# EAGLE board registers_half_layout_newwithwires (EAGLE 9.5.2), part 1 of 2
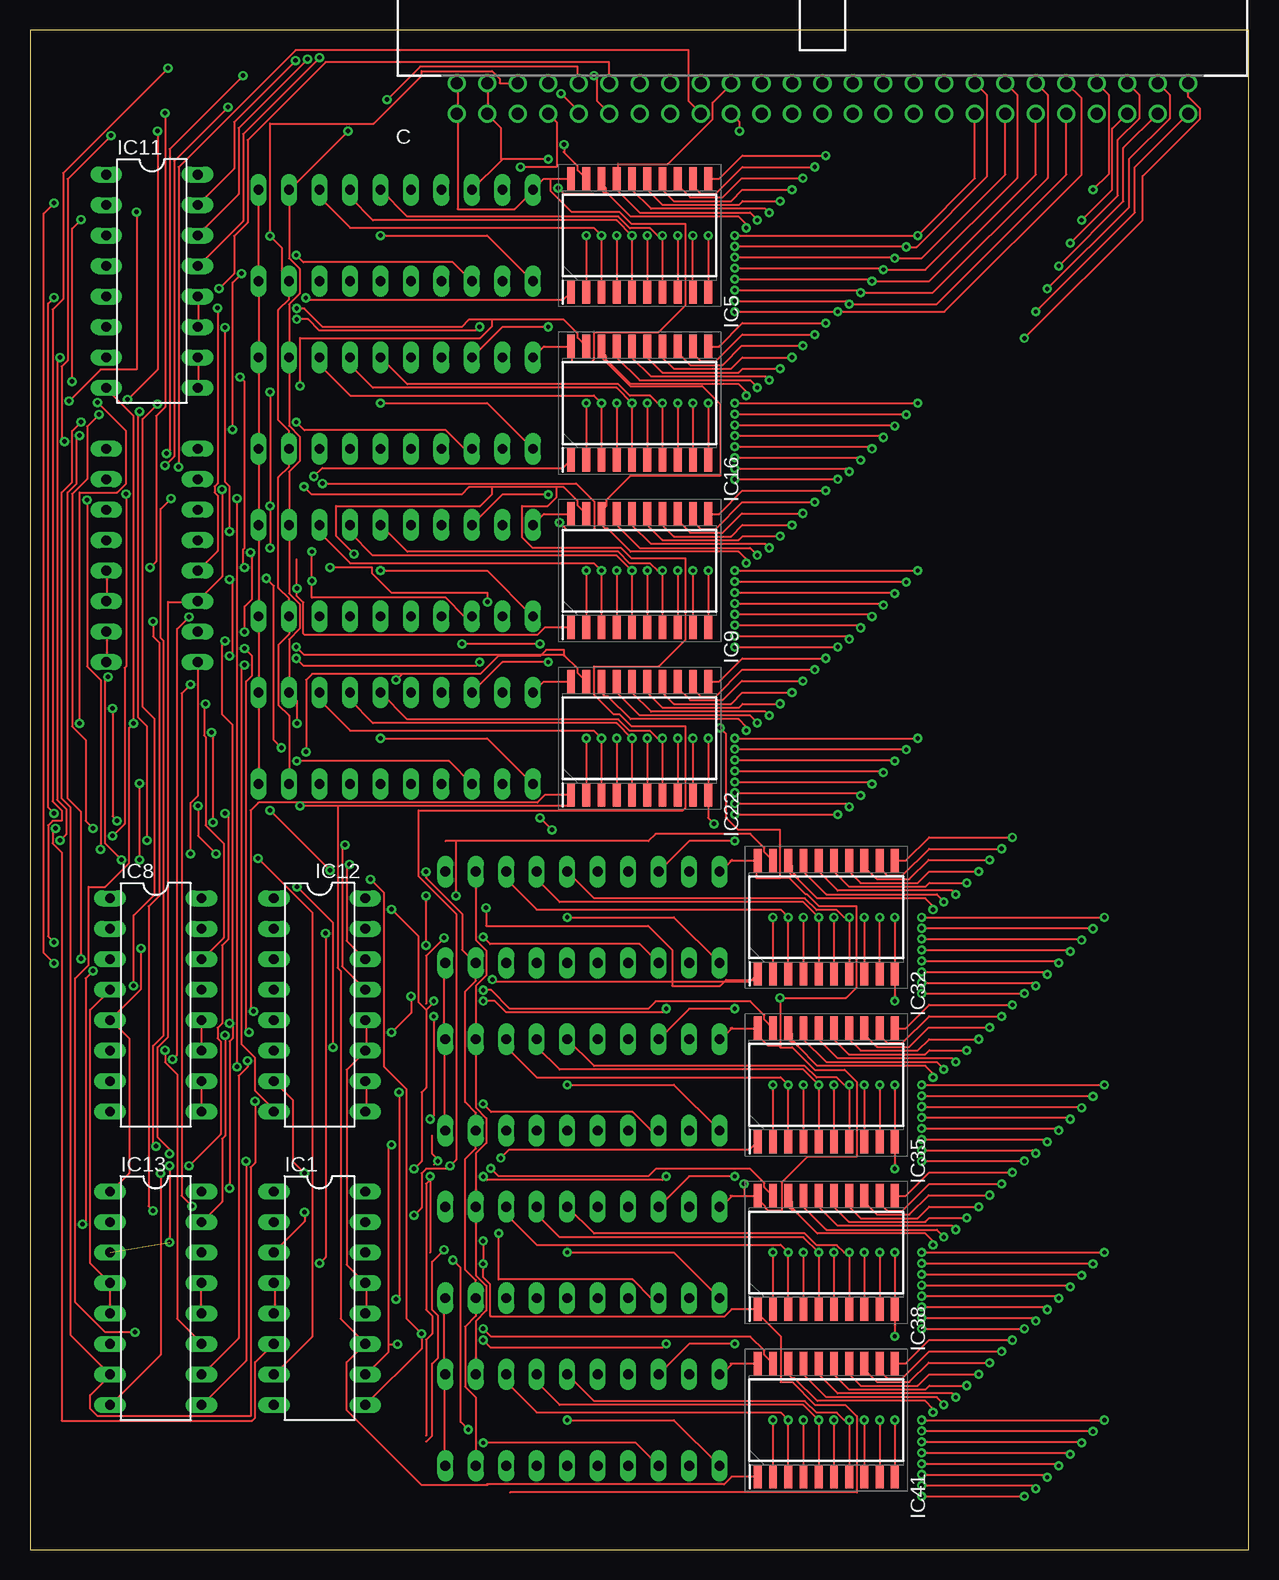
[diagram p2: board, top side]
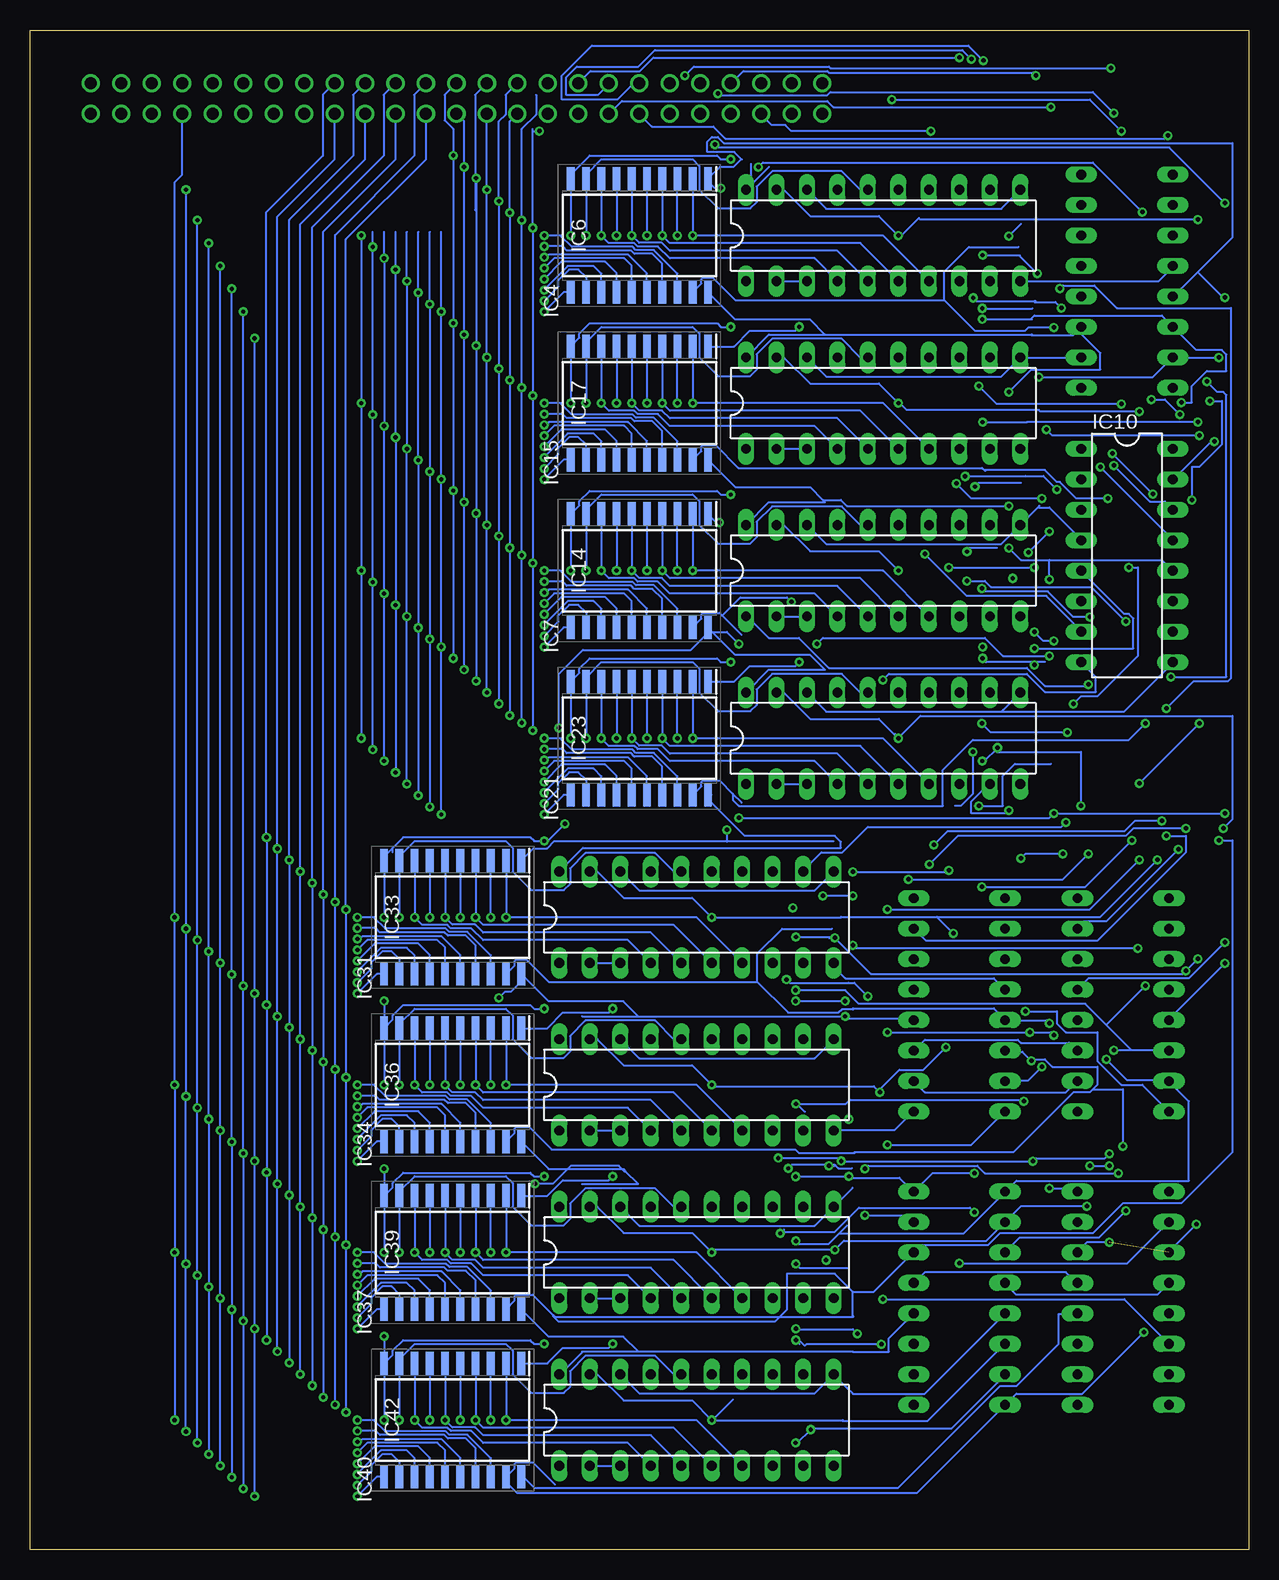
[diagram p3: board, bottom side, seen from below]

Size 101.58 x 126.67 mm. Coordinates in mm from the lower left corner, seen from the top.
Outline: 0,0 101.58,0 101.58,126.67 0,126.67 0,0
Copper layers (1*16): Top 0.035mm / dielectric 1.5mm / Bottom 0.035mm
Design rules "default *": minimum track width 6mil, minimum drill 0.35mm, track to track 6mil, track to pad 6mil, pad to pad 6mil, via to via 6mil, smd to smd 6mil, copper to edge 40mil, drill to drill 6mil, minimum pad ring 10mil, minimum via ring 8mil, stop-mask expansion 4mil, vias tented up to drill 0mil, thermal gap 10mil
tRestrict: area 61,4.1 to 97.8,122.2; area 92.7,114.6 to 101.6,122.2
bRestrict: area 58.4,4.1 to 90.2,122.2; area 90.2,114.6 to 101.6,122.2; area 88.9,114.6 to 90.2,122.2

## Footprints (pad centres in the part's own frame; a part is rotated, then mirrored left to right if it is on the bottom)
PAK100/2500-5-50 = drill 1 pad 1.422: 1 -30.48,-1.27; 2 -30.48,1.27; 3 -27.94,-1.27; 4 -27.94,1.27; 5 -25.4,-1.27; 6 -25.4,1.27; 7 -22.86,-1.27; 8 -22.86,1.27; 9 -20.32,-1.27; 10 -20.32,1.27; 11 -17.78,-1.27; 12 -17.78,1.27; 13 -15.24,-1.27; 14 -15.24,1.27; 15 -12.7,-1.27; 16 -12.7,1.27; 17 -10.16,-1.27; 18 -10.16,1.27; 19 -7.62,-1.27; 20 -7.62,1.27; 21 -5.08,-1.27; 22 -5.08,1.27; 23 -2.54,-1.27; 24 -2.54,1.27; 25 0,-1.27; 26 0,1.27; 27 2.54,-1.27; 28 2.54,1.27; 29 5.08,-1.27; 30 5.08,1.27; 31 7.62,-1.27; 32 7.62,1.27; 33 10.16,-1.27; 34 10.16,1.27; 35 12.7,-1.27; 36 12.7,1.27; 37 15.24,-1.27; 38 15.24,1.27; 39 17.78,-1.27; 40 17.78,1.27; 41 20.32,-1.27; 42 20.32,1.27; 43 22.86,-1.27; 44 22.86,1.27; 45 25.4,-1.27; 46 25.4,1.27; 47 27.94,-1.27; 48 27.94,1.27; 49 30.48,-1.27; 50 30.48,1.27
DIL16 = drill 0.813 long: 1 -8.89,-3.81; 2 -6.35,-3.81; 3 -3.81,-3.81; 4 -1.27,-3.81; 5 1.27,-3.81; 6 3.81,-3.81; 7 6.35,-3.81; 8 8.89,-3.81; 9 8.89,3.81; 10 6.35,3.81; 11 3.81,3.81; 12 1.27,3.81; 13 -1.27,3.81; 14 -3.81,3.81; 15 -6.35,3.81; 16 -8.89,3.81
DIL20 = drill 0.813 long: 1 -11.43,-3.81; 2 -8.89,-3.81; 3 -6.35,-3.81; 4 -3.81,-3.81; 5 -1.27,-3.81; 6 1.27,-3.81; 7 3.81,-3.81; 8 6.35,-3.81; 9 8.89,-3.81; 10 11.43,-3.81; 11 11.43,3.81; 12 8.89,3.81; 13 6.35,3.81; 14 3.81,3.81; 15 1.27,3.81; 16 -1.27,3.81; 17 -3.81,3.81; 18 -6.35,3.81; 19 -8.89,3.81; 20 -11.43,3.81
SOIC127P1030X265-20N = smd 1.95 x 0.65: 1 -4.725,5.715; 2 -4.725,4.445; 3 -4.725,3.175; 4 -4.725,1.905; 5 -4.725,0.635; 6 -4.725,-0.635; 7 -4.725,-1.905; 8 -4.725,-3.175; 9 -4.725,-4.445; 10 -4.725,-5.715; 11 4.725,-5.715; 12 4.725,-4.445; 13 4.725,-3.175; 14 4.725,-1.905; 15 4.725,-0.635; 16 4.725,0.635; 17 4.725,1.905; 18 4.725,3.175; 19 4.725,4.445; 20 4.725,5.715

## Placement (x,y rotation side)
C  2550-5  [PAK100/2500-5-50]  66.04,120.97 0 top
IC1  74AC11032  [DIL16]  24.13,20.95 270 top
IC4  74HCT299N  [DIL20]  30.48,109.54 0 bottom
IC5  SN74CBT3345DW  [SOIC127P1030X265-20N]  50.8,109.54 90 top
IC6  SN74CBT3345DW  [SOIC127P1030X265-20N]  50.8,109.54 270 bottom
IC7  74HCT299N  [DIL20]  30.48,81.6 0 bottom
IC8  74AC11138  [DIL16]  10.48,45.4 270 top
IC9  SN74CBT3345DW  [SOIC127P1030X265-20N]  50.8,81.6 90 top
IC10  74AC11238  [DIL16]  10.16,82.87 270 bottom
IC11  74AC11238  [DIL16]  10.16,105.73 270 top
IC12  74AC11138  [DIL16]  24.13,45.4 270 top
IC13  74AC11032  [DIL16]  10.48,20.95 270 top
IC14  SN74CBT3345DW  [SOIC127P1030X265-20N]  50.8,81.6 270 bottom
IC15  74HCT299N  [DIL20]  30.48,95.57 0 bottom
IC16  SN74CBT3345DW  [SOIC127P1030X265-20N]  50.8,95.57 90 top
IC17  SN74CBT3345DW  [SOIC127P1030X265-20N]  50.8,95.57 270 bottom
IC21  74HCT299N  [DIL20]  30.48,67.63 0 bottom
IC22  SN74CBT3345DW  [SOIC127P1030X265-20N]  50.8,67.63 90 top
IC23  SN74CBT3345DW  [SOIC127P1030X265-20N]  50.8,67.63 270 bottom
IC31  74HCT299N  [DIL20]  46.04,52.7 0 bottom
IC32  SN74CBT3345DW  [SOIC127P1030X265-20N]  66.36,52.7 90 top
IC33  SN74CBT3345DW  [SOIC127P1030X265-20N]  66.36,52.7 270 bottom
IC34  74HCT299N  [DIL20]  46.04,38.73 0 bottom
IC35  SN74CBT3345DW  [SOIC127P1030X265-20N]  66.36,38.73 90 top
IC36  SN74CBT3345DW  [SOIC127P1030X265-20N]  66.36,38.73 270 bottom
IC37  74HCT299N  [DIL20]  46.04,24.77 0 bottom
IC38  SN74CBT3345DW  [SOIC127P1030X265-20N]  66.36,24.77 90 top
IC39  SN74CBT3345DW  [SOIC127P1030X265-20N]  66.36,24.77 270 bottom
IC40  74HCT299N  [DIL20]  46.04,10.79 0 bottom
IC41  SN74CBT3345DW  [SOIC127P1030X265-20N]  66.36,10.79 90 top
IC42  SN74CBT3345DW  [SOIC127P1030X265-20N]  66.36,10.79 270 bottom

## Tracks (layer width: path | path; a pad name or v marks a point on that pad's centre or on a via)
BUSA_BIT0  (via drill 0.35)
  Top 0.152: v59.69,110.17 59.69,110.49 59.05,111.12 50.05,111.12 48.15,113.03 48,113.03 | 47.62,113.35 47.94,113.03 48,113.03 | v59.69,96.2 59.69,96.52 59.05,97.16 50.05,97.16 48.15,99.06 48,99.06 | 47.62,99.38 47.94,99.06 48,99.06 | v59.69,82.23 59.69,82.55 59.05,83.19 50.05,83.19 48.15,85.09 47.94,85.09 47.62,85.41 | v59.69,68.26 59.69,68.58 59.05,69.22 50.05,69.22 48.15,71.12 47.94,71.12 47.62,71.44 IC22.18 | IC9.18 47.5,86.5 48,87 48,87.5 50,89.5 57.5,89.5 57.5,95.5 56,97 50,97 48,99 48,99.06 | 48,99.06 48,99.5 47.5,100 IC16.18 | 48,113.03 48,113.5 47.5,114 IC5.18 | 48,113 48,113.03 | v59.12,118.25 59.12,119 58.5,119.62 C.19
  Bottom 0.152: v59.69,68.26 v59.69,82.23 v59.69,96.2 v59.69,110.17 59.69,118.25 | 59.69,118.25 59.69,118.43 | 59.69,118.25 v59.12,118.25
BUSA_BIT1  (via drill 0.35)
  Top 0.152: v60.6,110.82 60.6,110.85 60.01,111.44 50.8,111.44 48.9,113.35 IC5.17 49,114.38 49,115.5 53.12,115.5 56.88,119.25 56.88,120.62 58.38,122.12 C.20 | v60.6,96.85 60.6,96.88 60.01,97.47 50.8,97.47 48.9,99.38 IC16.17 | v60.6,82.88 60.6,82.91 60.01,83.5 50.8,83.5 48.9,85.41 IC9.17 | v60.6,68.91 60.6,68.94 60.01,69.53 50.8,69.53 48.9,71.44 IC22.17
  Bottom 0.152: v60.6,68.91 v60.6,82.88 v60.6,96.85 v60.6,110.82 60.6,118.43 59.4,119.62 59.4,121.25
BUSA_BIT2  (via drill 0.35)
  Top 0.152: v61.59,111.44 61.28,111.76 51.75,111.76 50.16,113.35 IC5.16 | v61.59,97.47 61.28,97.79 51.75,97.79 50.16,99.38 IC16.16 | v61.59,83.5 61.28,83.82 51.75,83.82 50.16,85.41 IC9.16 | v61.59,69.53 61.28,69.85 51.75,69.85 50.16,71.44 IC22.16
  Bottom 0.152: v61.59,69.53 v61.59,83.5 v61.59,97.47 v61.59,111.44 61.59,119.06 C.21
BUSA_BIT3  (via drill 0.35)
  Top 0.152: v62.5,112.41 59.39,112.41 59.05,112.08 59.04,112.09 52.69,112.09 51.44,113.35 IC5.15 | v62.5,98.44 59.39,98.44 59.05,98.11 59.04,98.12 52.69,98.12 51.44,99.38 IC16.15 | v62.5,84.47 59.39,84.47 59.05,84.14 59.04,84.15 52.69,84.15 51.44,85.41 IC9.15 | v62.5,70.5 59.39,70.5 59.05,70.17 59.04,70.18 52.69,70.18 51.44,71.44 IC22.15
  Bottom 0.152: v62.5,70.5 v62.5,84.47 v62.5,98.44 v62.5,112.41 62.5,119.06 61.94,119.62 61.94,121.25 C.22
BUSA_BIT4  (via drill 0.35)
  Top 0.152: v63.5,113.35 59.37,113.35 58.42,112.39 53.66,112.39 52.7,113.35 IC5.14 | v63.5,99.38 59.37,99.38 58.42,98.42 53.66,98.42 52.7,99.38 IC16.14 | v63.5,85.41 59.37,85.41 58.42,84.45 53.66,84.45 52.7,85.41 IC9.14 | v63.5,71.44 59.37,71.44 58.42,70.48 53.66,70.48 52.7,71.44 IC22.14
  Bottom 0.152: v63.5,71.44 v63.5,85.41 v63.5,99.38 v63.5,113.35 C.23
BUSA_BIT5  (via drill 0.35)
  Top 0.152: IC5.13 53.98,113.75 55.01,112.71 57.73,112.71 59.33,114.32 v64.41,114.32 | IC16.13 53.98,99.78 55.01,98.74 57.73,98.74 59.33,100.35 v64.41,100.35 | IC9.13 53.98,85.81 55.01,84.77 57.73,84.77 59.33,86.38 v64.41,86.38 | IC22.13 53.98,71.84 55.01,70.8 57.73,70.8 59.33,72.41 v64.41,72.41
  Bottom 0.152: v64.41,72.41 v64.41,86.38 v64.41,100.35 v64.41,114.32 64.45,114.36 64.45,111.64 64.48,111.67 64.48,121.25 C.24
BUSA_BIT6  (via drill 0.35)
  Top 0.152: v65.41,115.25 59.37,115.25 57.14,113.02 55.88,113.02 55.24,113.65 IC5.12 | v65.41,101.28 59.37,101.28 57.14,99.05 55.88,99.05 55.24,99.68 IC16.12 | v65.41,87.31 59.37,87.31 57.14,85.08 55.88,85.08 55.24,85.71 IC9.12 | v65.41,73.34 59.37,73.34 57.14,71.11 55.88,71.11 55.24,71.74 IC22.12
  Bottom 0.152: v65.41,73.34 v65.41,87.31 v65.41,101.28 v65.41,115.25 65.41,119.06 C.25
BUSA_BIT7  (via drill 0.35)
  Top 0.152: v66.31,116.2 59.37,116.2 57.43,114.26 IC5.11 | v66.31,102.23 59.37,102.23 57.43,100.29 IC16.11 | v66.31,88.27 59.37,88.27 57.43,86.32 IC9.11 | v66.31,74.3 59.37,74.3 57.43,72.35 IC22.11
  Bottom 0.152: v66.31,74.3 v66.31,88.27 v66.31,102.23 v66.31,116.2 66.31,118.43 67.02,119.14 67.02,121.25 C.26
BUSA_BIT8  (via drill 0.35)
  Top 0.152: v75.25,53.34 75.25,53.66 74.61,54.29 65.61,54.29 63.95,55.95 | 63.18,56.52 63.5,56.2 63.7,56.2 63.95,55.95 | v75.25,39.37 75.25,39.69 74.61,40.32 65.61,40.32 63.97,41.97 | 63.18,42.55 63.5,42.23 63.7,42.23 63.97,41.97 | v75.25,25.4 75.25,25.72 74.61,26.35 65.61,26.35 63.98,27.98 | 63.18,28.57 63.5,28.26 63.7,28.26 63.98,27.98 | v75.25,11.43 75.25,11.75 74.61,12.38 65.61,12.38 63.7,14.29 63.5,14.29 63.18,14.61 IC41.18 | IC38.18 63.5,29 63.5,28.5 64,28 63.98,27.98 | IC35.18 63.5,43 63.5,42.5 64,42 63.97,41.97 | IC32.18 63.5,57 63.5,56.5 64,56 63.95,55.95
  Bottom 0.152: v75.25,11.43 v75.25,25.4 v75.25,39.37 v75.25,53.34 75.25,109.22 68.58,115.89 C.27
BUSA_BIT9  (via drill 0.35)
  Top 0.152: v76.16,53.99 76.16,54.02 75.56,54.61 66.36,54.61 64.45,56.52 IC32.17 | v76.16,40.02 76.16,40.05 75.56,40.64 66.36,40.64 64.45,42.55 IC35.17 | v76.16,26.05 76.16,26.08 75.56,26.67 66.36,26.67 64.45,28.57 IC38.17 | v76.16,12.08 76.16,12.11 75.56,12.7 66.36,12.7 64.45,14.61 IC41.17
  Bottom 0.152: v76.16,12.08 v76.16,26.05 v76.16,40.02 v76.16,53.99 76.16,109.58 69.56,116.17 69.56,121.25 C.28
BUSA_BIT10  (via drill 0.35)
  Top 0.152: v77.15,54.61 76.83,54.93 67.31,54.93 65.72,56.52 IC32.16 | v77.15,40.64 76.83,40.96 67.31,40.96 65.72,42.55 IC35.16 | v77.15,26.67 76.83,26.99 67.31,26.99 65.72,28.57 IC38.16 | v77.15,12.7 76.83,13.02 67.31,13.02 65.72,14.61 IC41.16
  Bottom 0.152: v77.15,12.7 v77.15,26.67 v77.15,40.64 v77.15,54.61 77.15,109.86 71.12,115.89 C.29
BUSA_BIT11  (via drill 0.35)
  Top 0.152: v78.06,55.58 74.94,55.58 74.61,55.24 74.6,55.26 68.25,55.26 66.99,56.52 IC32.15 | v78.06,41.61 74.94,41.61 74.61,41.27 74.6,41.29 68.25,41.29 66.99,42.55 IC35.15 | v78.06,27.64 74.94,27.64 74.61,27.3 74.6,27.32 68.25,27.32 66.99,28.57 IC38.15 | v78.06,13.67 74.94,13.67 74.61,13.34 74.6,13.35 68.25,13.35 66.99,14.61 IC41.15
  Bottom 0.152: v78.06,13.67 v78.06,27.64 v78.06,41.61 v78.06,55.58 78.06,110.22 72.1,116.17 72.1,121.25 C.30
BUSA_BIT12  (via drill 0.35)
  Top 0.152: v79.06,56.52 74.93,56.52 73.98,55.56 69.22,55.56 68.26,56.52 IC32.14 | v79.06,42.55 74.93,42.55 73.98,41.59 69.22,41.59 68.26,42.55 IC35.14 | v79.06,28.57 74.93,28.57 73.98,27.62 69.22,27.62 68.26,28.57 IC38.14 | v79.06,14.61 74.93,14.61 73.98,13.65 69.22,13.65 68.26,14.61 IC41.14
  Bottom 0.152: v79.06,14.61 v79.06,28.57 v79.06,42.55 v79.06,56.52 79.06,110.49 73.66,115.89 C.31
BUSA_BIT13  (via drill 0.35)
  Top 0.152: IC32.13 69.53,56.91 70.57,55.88 73.28,55.88 74.89,57.48 v79.97,57.48 | IC35.13 69.53,42.94 70.57,41.91 73.28,41.91 74.89,43.51 v79.97,43.51 | IC38.13 69.53,28.97 70.57,27.94 73.28,27.94 74.89,29.54 v79.97,29.54 | IC41.13 69.53,15 70.57,13.97 73.28,13.97 74.89,15.57 v79.97,15.57
  Bottom 0.152: v79.97,15.57 v79.97,29.54 v79.97,43.51 v79.97,57.48 79.97,110.85 74.64,116.17 74.64,121.25 C.32
BUSA_BIT14  (via drill 0.35)
  Top 0.152: v80.96,58.42 74.93,58.42 72.69,56.19 71.44,56.19 70.8,56.82 IC32.12 | v80.96,44.45 74.93,44.45 72.69,42.22 71.44,42.22 70.8,42.85 IC35.12 | v80.96,30.48 74.93,30.48 72.69,28.25 71.44,28.25 70.8,28.88 IC38.12 | v80.96,16.51 74.93,16.51 72.69,14.28 71.44,14.28 70.8,14.91 IC41.12
  Bottom 0.152: v80.96,16.51 v80.96,30.48 v80.96,44.45 v80.96,58.42 80.96,111.12 76.2,115.89 C.33
BUSA_BIT15  (via drill 0.35)
  Top 0.152: v81.87,59.37 74.93,59.37 72.99,57.43 IC32.11 | v81.87,45.4 74.93,45.4 72.99,43.46 IC35.11 | v81.87,31.43 74.93,31.43 72.99,29.49 IC38.11 | v81.87,17.46 74.93,17.46 72.99,15.52 IC41.11
  Bottom 0.152: v81.87,17.46 v81.87,31.43 v81.87,45.4 v81.87,59.37 81.92,59.42 81.92,111.44 77.18,116.17 77.18,121.25 C.34
BUSA_REGIN0  (via drill 0.35)
  Top 0.152: v5.88,58.38 5.88,72.5 4.75,73.62 v4.75,87.5 | v3.25,95.75 5.88,98.38 8.88,98.38 v8.88,111.5 | v40.88,115.25 43.88,115.25 43.88,119 43.25,119.62 C.7
  Bottom 0.152: v5.88,58.38 11.88,52.38 13.75,52.38 14.25,51.88 IC8.15 | v4.75,87.5 4.75,90.25 4.12,90.25 2.25,92.12 2.25,95.75 v3.25,95.75 | v8.88,111.5 13,115.62 40.5,115.62 v40.88,115.25
BUSA_REGIN1  (via drill 0.35)
  Top 0.152: v14.62,70.5 14.5,70.38 14.5,67.88 14.62,67.75 14.62,60.38 16.12,58.88 16.12,51 14.38,49.25 IC8.14 | v10,81.88 10.5,82.38 10.5,94.5 11.25,95.25 v11.25,119.75 | v44.25,121.38 45.62,120 45.62,119.75 C.9
  Bottom 0.152: v14.62,70.5 14,71.12 12.62,71.12 9.25,74.5 9.25,81.88 v10,81.88 | v11.25,119.75 13,121.5 34.88,121.5 35.12,121.25 44.12,121.25 v44.25,121.38
BUSA_REGIN2  (via drill 0.35)
  Top 0.152: v2,50.62 1.5,51.12 1.5,60.38 1.88,60.75 2.62,60.75 2.62,61.62 1.88,62.38 1.88,103.38 2.75,104.25 2.75,114.75 v11.5,123.5 | v47,122.88 47.25,122.62 47.25,120.75 48.25,119.75 C.11
  Bottom 0.152: v2,50.62 5,47.62 13.38,47.62 14.25,46.75 IC8.13 | v11.5,123.5 34.88,123.5 35,123.62 46.25,123.62 v47,122.88
BUSA_REGOUT0  (via drill 0.35)
  Top 0.152: v2.88,92.38 2.62,92.62 2.62,98.62 3.12,99.12 3.12,114.25 v6.75,117.88
  Bottom 0.152: v2.88,92.38 3.12,92.38 6.25,89.25 IC10.15 | v6.75,117.88 7,117.62 43.62,117.62 44.62,118.62 49.75,118.62 50.75,119.62 C.13
BUSA_REGOUT1  (via drill 0.35)
  Top 0.152: v11.25,90.38 12,91.12 12,115.75 v16.5,120.25
  Bottom 0.152: v11.25,90.38 8.25,87.38 7,87.38 6.38,86.75 IC10.14 | v16.5,120.25 34.62,120.25 35.12,120.75 52.25,120.75 53.25,119.75 C.15
BUSA_REGOUT2  (via drill 0.35)
  Top 0.152: v12.38,90.25 12.38,115.25 22.12,125 54.88,125 54.88,120.75 55.88,119.75 C.17
  Bottom 0.152: v12.38,90.25 6.38,84.25 IC10.13
BUSB_BIT0  (via drill 0.35)
  Top 0.152: v58.74,109.54 v73.98,109.54 78.74,114.3 C.35 | v58.74,95.57 v73.98,95.57 | v58.74,81.6 v73.98,81.6 | v58.74,67.63 v73.98,67.63
  Bottom 0.152: IC6.18 47.62,106.36 49.58,108.32 51.08,108.32 51.36,108.6 56.43,108.6 57.37,109.54 v58.74,109.54 | IC17.18 47.62,92.39 49.58,94.35 51.08,94.35 51.36,94.63 56.43,94.63 57.37,95.57 v58.74,95.57 | IC14.18 47.62,78.42 49.58,80.38 51.08,80.38 51.36,80.66 56.43,80.66 57.37,81.6 v58.74,81.6 | IC23.18 47.62,64.45 49.58,66.41 51.08,66.41 51.36,66.69 56.43,66.69 57.37,67.63 v58.74,67.63 | v73.98,67.63 v73.98,81.6 v73.98,95.57 v73.98,109.54 73.98,109.86
BUSB_BIT1  (via drill 0.35)
  Top 0.152: v58.74,108.63 72.98,108.63 v73.03,108.58 73.88,108.58 79.72,114.42 79.72,121.25 C.36 | v58.74,94.66 72.98,94.66 v73.03,94.61 | v58.74,80.69 72.98,80.69 v73.03,80.64 | v58.74,66.72 72.98,66.72 v73.03,66.67
  Bottom 0.152: v58.74,108.63 57.19,108.63 56.86,108.29 51.48,108.29 51.21,108.02 49.71,108.02 48.9,107.2 IC6.17 | v58.74,94.66 57.19,94.66 56.86,94.32 51.48,94.32 51.21,94.05 49.71,94.05 48.9,93.23 IC17.17 | v58.74,80.69 57.19,80.69 56.86,80.35 51.48,80.35 51.21,80.08 49.71,80.08 48.9,79.26 IC14.17 | v58.74,66.72 57.19,66.72 56.86,66.38 51.48,66.38 51.21,66.11 49.71,66.11 48.9,65.29 IC23.17 | v73.03,66.67 v73.03,80.64 v73.03,94.61 v73.03,108.58 73.03,109.86
BUSB_BIT2  (via drill 0.35)
  Top 0.152: v58.74,107.72 71.98,107.72 v72.07,107.63 74.3,107.63 81.28,114.62 C.37 | v58.74,93.75 71.98,93.75 v72.07,93.66 | v58.74,79.78 71.98,79.78 v72.07,79.69 | v58.74,65.81 71.98,65.81 v72.07,65.72
  Bottom 0.152: IC6.16 50.16,106.39 51.73,107.95 58.33,107.95 58.56,107.72 v58.74,107.72 | IC17.16 50.16,92.42 51.73,93.98 58.33,93.98 58.56,93.75 v58.74,93.75 | IC14.16 50.16,78.45 51.73,80.01 58.33,80.01 58.56,79.78 v58.74,79.78 | IC23.16 50.16,64.48 51.73,66.04 58.33,66.04 58.56,65.81 v58.74,65.81 | v72.07,65.72 v72.07,79.69 v72.07,93.66 v72.07,107.63 72.07,109.86
BUSB_BIT3  (via drill 0.35)
  Top 0.152: v58.74,106.81 70.99,106.81 v71.12,106.68 74.61,106.68 82.26,114.33 82.26,121.25 C.38 | v58.74,92.84 70.99,92.84 v71.12,92.71 | v58.74,78.87 70.99,78.87 v71.12,78.74 | v58.74,64.9 70.99,64.9 v71.12,64.77
  Bottom 0.152: v58.74,106.81 57.9,107.64 52.07,107.64 51.44,107.01 IC6.15 | v58.74,92.84 57.9,93.67 52.07,93.67 51.44,93.04 IC17.15 | v58.74,78.87 57.9,79.7 52.07,79.7 51.44,79.07 IC14.15 | v58.74,64.9 57.9,65.73 52.07,65.73 51.44,65.1 IC23.15 | v71.12,64.77 v71.12,78.74 v71.12,92.71 v71.12,106.68 71.12,109.86
BUSB_BIT4  (via drill 0.35)
  Top 0.152: v58.74,105.9 69.99,105.9 v70.17,105.73 74.93,105.73 83.82,114.62 C.39 | v58.74,91.93 69.99,91.93 v70.17,91.76 | v58.74,77.96 69.99,77.96 v70.17,77.79 | v58.74,63.99 69.99,63.99 v70.17,63.82
  Bottom 0.152: IC6.14 52.7,106.39 53.66,107.34 57.3,107.34 v58.74,105.9 | IC17.14 52.7,92.42 53.66,93.37 57.3,93.37 v58.74,91.93 | IC14.14 52.7,78.45 53.66,79.4 57.3,79.4 v58.74,77.96 | IC23.14 52.7,64.48 53.66,65.43 57.3,65.43 v58.74,63.99 | v70.17,63.82 v70.17,77.79 v70.17,91.76 v70.17,105.73 70.17,109.86
BUSB_BIT5  (via drill 0.35)
  Top 0.152: v58.74,104.99 69,104.99 v69.22,104.78 75.25,104.78 84.8,114.33 84.8,121.25 C.40 | v58.74,91.02 69,91.02 v69.22,90.81 | v58.74,77.05 69,77.05 v69.22,76.83 | v58.74,63.08 69,63.08 v69.22,62.87
  Bottom 0.152: IC6.13 53.98,106.36 54.61,107 56.78,107 58.74,105.04 v58.74,104.99 | IC17.13 53.98,92.39 54.61,93.03 56.78,93.03 58.74,91.07 v58.74,91.02 | IC14.13 53.98,78.42 54.61,79.06 56.78,79.06 58.74,77.1 v58.74,77.05 | IC23.13 53.98,64.45 54.61,65.09 56.78,65.09 58.74,63.13 v58.74,63.08 | v69.22,62.87 v69.22,76.83 v69.22,90.81 v69.22,104.78 69.22,109.86
BUSB_BIT6  (via drill 0.35)
  Top 0.152: v58.74,104.08 68,104.08 v68.26,103.82 75.56,103.82 86.36,114.62 C.41 | v58.74,90.11 68,90.11 v68.26,89.85 | v58.74,76.14 68,76.14 v68.26,75.88 | v58.74,62.17 68,62.17 v68.26,61.91
  Bottom 0.152: v58.74,104.08 57.55,105.28 57.55,105.81 56.66,106.69 55.88,106.69 55.24,106.06 IC6.12 | v58.74,90.11 57.55,91.31 57.55,91.83 56.66,92.72 55.88,92.72 55.24,92.09 IC17.12 | v58.74,76.14 57.55,77.34 57.55,77.86 56.66,78.75 55.88,78.75 55.24,78.12 IC14.12 | v58.74,62.17 57.55,63.37 57.55,63.9 56.66,64.78 55.88,64.78 55.24,64.15 IC23.12 | v68.26,61.91 v68.26,75.88 v68.26,89.85 v68.26,103.82 68.26,109.86
BUSB_BIT7  (via drill 0.35)
  Top 0.152: v58.74,103.18 v58.75,103.19 v67.31,103.19 76.2,103.19 87.63,114.62 87.63,120.97 C.42 | v58.74,89.21 v58.75,89.22 v67.31,89.22 | v58.74,75.24 v58.75,75.25 v67.31,75.25 | v58.74,61.27 v58.75,61.28 v67.31,61.28
  Bottom 0.152: IC6.11 57.11,104.81 v58.74,103.19 v58.74,103.18 | IC17.11 57.11,90.84 v58.74,89.22 v58.74,89.21 | IC14.11 57.11,76.87 v58.74,75.25 v58.74,75.24 | IC23.11 57.11,62.9 v58.74,61.28 v58.74,61.27 | v67.31,61.28 v67.31,75.25 v67.31,89.22 v67.31,103.19 67.31,109.86
BUSB_BIT8  (via drill 0.35)
  Top 0.152: v74.3,38.73 v89.53,38.73 | v74.3,24.77 v89.53,24.77 | v74.3,10.79 v89.53,10.79 | v74.3,52.7 v89.53,52.7
  Bottom 0.152: IC33.18 63.18,49.53 65.14,51.49 66.64,51.49 66.92,51.77 71.99,51.77 72.93,52.7 v74.3,52.7 | IC36.18 63.18,35.56 65.14,37.52 66.64,37.52 66.92,37.8 71.99,37.8 72.93,38.73 v74.3,38.73 | IC39.18 63.18,21.59 65.14,23.55 66.64,23.55 66.92,23.82 71.99,23.82 72.93,24.77 v74.3,24.77 | IC42.18 63.18,7.62 65.14,9.58 66.64,9.58 66.92,9.86 71.99,9.86 72.93,10.79 v74.3,10.79 | v89.53,10.79 v89.53,24.77 v89.53,38.73 v89.53,52.7 89.53,113.98 88.9,114.62 C.43
BUSB_BIT9  (via drill 0.35)
  Top 0.152: v74.3,37.83 88.54,37.83 v88.58,37.78 | v74.3,23.86 88.54,23.86 v88.58,23.81 | v74.3,9.89 88.54,9.89 v88.58,9.84 | C.44 89.88,121.25 89.88,114.65 v88.58,113.35 | v74.3,51.8 88.54,51.8 v88.58,51.75
  Bottom 0.152: v74.3,51.8 72.75,51.8 72.42,51.46 67.04,51.46 66.76,51.18 65.27,51.18 64.45,50.37 IC33.17 | v74.3,37.83 72.75,37.83 72.42,37.49 67.04,37.49 66.76,37.21 65.27,37.21 64.45,36.4 IC36.17 | v74.3,23.86 72.75,23.86 72.42,23.52 67.04,23.52 66.76,23.24 65.27,23.24 64.45,22.43 IC39.17 | v74.3,9.89 72.75,9.89 72.42,9.55 67.04,9.55 66.76,9.27 65.27,9.27 64.45,8.46 IC42.17 | v88.58,9.84 v88.58,23.81 v88.58,37.78 v88.58,51.75 v88.58,113.35
BUSB_BIT10  (via drill 0.35)
  Top 0.152: v74.3,36.92 87.54,36.92 v87.63,36.83 | v74.3,22.95 87.54,22.95 v87.63,22.86 | v74.3,8.98 87.54,8.98 v87.63,8.89 | v87.63,110.81 90.17,113.35 90.17,114.5 90.19,114.52 90.19,118.44 C.45 | v74.3,50.89 87.54,50.89 v87.63,50.8
  Bottom 0.152: IC33.16 65.72,49.55 67.28,51.12 73.89,51.12 74.12,50.89 v74.3,50.89 | IC36.16 65.72,35.59 67.28,37.15 73.89,37.15 74.12,36.92 v74.3,36.92 | IC39.16 65.72,21.61 67.28,23.18 73.89,23.18 74.12,22.95 v74.3,22.95 | IC42.16 65.72,7.64 67.28,9.21 73.89,9.21 74.12,8.98 v74.3,8.98 | v87.63,8.89 v87.63,22.86 v87.63,36.83 v87.63,50.8 v87.63,110.81
BUSB_BIT11  (via drill 0.35)
  Top 0.152: v74.3,36.01 86.55,36.01 v86.68,35.88 | v74.3,22.04 86.55,22.04 v86.68,21.91 | v74.3,8.07 86.55,8.07 v86.68,7.94 | C.46 92.42,121.25 92.42,119.29 90.65,117.51 90.65,112.87 v86.68,108.9 | v74.3,49.98 86.55,49.98 v86.68,49.85
  Bottom 0.152: v74.3,49.98 73.46,50.81 67.63,50.81 66.99,50.18 IC33.15 | v74.3,36.01 73.46,36.84 67.63,36.84 66.99,36.21 IC36.15 | v74.3,22.04 73.46,22.87 67.63,22.87 66.99,22.24 IC39.15 | v74.3,8.07 73.46,8.9 67.63,8.9 66.99,8.27 IC42.15 | v86.68,7.94 v86.68,21.91 v86.68,35.88 v86.68,49.85 v86.68,108.9
BUSB_BIT12  (via drill 0.35)
  Top 0.152: v74.3,35.1 85.55,35.1 v85.72,34.92 | v74.3,21.13 85.55,21.13 v85.72,20.95 | v74.3,7.16 85.55,7.16 v85.72,6.99 | v85.72,107 91.12,112.39 91.12,116.84 C.47 | v74.3,49.07 85.55,49.07 v85.72,48.9
  Bottom 0.152: IC33.14 68.26,49.55 69.22,50.51 72.86,50.51 v74.3,49.07 | IC36.14 68.26,35.59 69.22,36.54 72.86,36.54 v74.3,35.1 | IC39.14 68.26,21.61 69.22,22.57 72.86,22.57 v74.3,21.13 | IC42.14 68.26,7.64 69.22,8.6 72.86,8.6 v74.3,7.16 | v85.72,6.99 v85.72,20.95 v85.72,34.92 v85.72,48.9 v85.72,107
BUSB_BIT13  (via drill 0.35)
  Top 0.152: v74.3,34.19 84.55,34.19 v84.77,33.97 | v74.3,20.22 84.55,20.22 v84.77,20 | v74.3,6.25 84.55,6.25 v84.77,6.03 | v84.77,105.09 91.6,111.92 91.6,115.93 94.96,119.29 94.96,121.25 C.48 | v74.3,48.16 84.55,48.16 v84.77,47.94
  Bottom 0.152: IC33.13 69.53,49.53 70.17,50.16 72.34,50.16 74.3,48.21 v74.3,48.16 | IC36.13 69.53,35.56 70.17,36.2 72.34,36.2 74.3,34.24 v74.3,34.19 | IC39.13 69.53,21.59 70.17,22.23 72.34,22.23 74.3,20.27 v74.3,20.22 | IC42.13 69.53,7.62 70.17,8.26 72.34,8.26 74.3,6.3 v74.3,6.25 | v84.77,6.03 v84.77,20 v84.77,33.97 v84.77,47.94 v84.77,105.09
BUSB_BIT14  (via drill 0.35)
  Top 0.152: v74.3,33.28 83.56,33.28 v83.82,33.02 | v74.3,19.31 83.56,19.31 v83.82,19.05 | v74.3,5.34 83.56,5.34 v83.82,5.08 | v83.82,103.19 92.08,111.44 92.08,115.25 C.49 | v74.3,47.25 83.56,47.25 v83.82,46.99
  Bottom 0.152: v74.3,47.25 73.1,48.44 73.1,48.97 72.22,49.86 71.44,49.86 70.8,49.23 IC33.12 | v74.3,33.28 73.1,34.47 73.1,35 72.22,35.89 71.44,35.89 70.8,35.26 IC36.12 | v74.3,19.31 73.1,20.5 73.1,21.03 72.22,21.92 71.44,21.92 70.8,21.29 IC39.12 | v74.3,5.34 73.1,6.53 73.1,7.06 72.22,7.95 71.44,7.95 70.8,7.32 IC42.12 | v83.82,5.08 v83.82,19.05 v83.82,33.02 v83.82,46.99 v83.82,103.19
BUSB_BIT15  (via drill 0.35)
  Top 0.152: 74.31,46.35 v74.3,46.34 82.86,46.34 v82.87,46.35 | v74.3,32.37 74.31,32.38 v82.87,32.38 | v74.3,18.4 74.31,18.41 v82.87,18.41 | v74.3,4.43 74.31,4.45 v82.87,4.45 | v82.87,100.97 92.71,110.81 92.71,114.5 97.5,119.29 97.5,120.11 96.52,121.09 C.50
  Bottom 0.152: IC33.11 72.67,47.98 74.3,46.35 v74.3,46.34 | IC36.11 72.67,34.01 74.3,32.38 v74.3,32.37 | IC39.11 72.67,20.04 74.3,18.41 v74.3,18.4 | IC42.11 72.67,6.07 74.3,4.45 v74.3,4.43 | v82.87,4.45 v82.87,18.41 v82.87,32.38 v82.87,46.35 v82.87,100.97
BUSB_REGIN0  (via drill 0.35)
  Top 0.152: v6.88,59.5 7.88,60.5 7.88,73.5 8,73.62 v8,88 | v11.38,91.38 11.62,91.62 11.62,116.75 v17.75,122.88
  Bottom 0.152: v6.88,59.5 5.25,59.5 5.25,58.12 12.62,50.75 26.88,50.75 27.88,51.75 IC12.15 | v11.38,91.38 v8,88 | v17.75,122.88 18,123.12 35,123.12 35.12,123.25 42.12,123.25 43.12,122.25 C.8
BUSB_REGIN1  (via drill 0.35)
  Top 0.152: v26.62,57.12 26.38,56.88 26.38,50.75 27.88,49.25 IC12.14 | v5.25,60.12 4.62,60.75 4.62,67.5 3.5,68.62 3.5,88 4.75,89.25 4.75,93.62 v5.75,94.62 | v8.12,95.88 10.62,98.38 v10.62,118.25 | v29.75,120.88 32.5,123.62 45.62,123.62 45.62,122.25 C.10
  Bottom 0.152: v26.62,57.12 24.25,59.5 10.25,59.5 9.62,60.12 v5.25,60.12 | v5.75,94.62 7,95.88 v8.12,95.88 | v10.62,118.25 13.25,120.88 v29.75,120.88
BUSB_REGIN2  (via drill 0.35)
  Top 0.152: v26.25,58.75 26,58.5 26,48.62 27.88,46.75 IC12.13 | v7.25,60.75 6.88,61.12 v6.88,70.12 | v15.75,105.12 17,106.38 17,109.5 18.12,110.62 18.12,117.5 24.62,124 48.25,124 C.12
  Bottom 0.152: v26.25,58.75 25.12,59.88 10.38,59.88 9.5,60.75 v7.25,60.75 | v6.88,70.12 4.62,72.38 1.75,72.38 1.5,72.62 1.5,103.5 11,103.5 12.88,105.38 15.5,105.38 v15.75,105.12
BUSB_REGOUT0  (via drill 0.35)
  Top 0.152: v22.12,124.12 17,119 17,115.12 14,112.12 IC11.15
  Bottom 0.152: v22.12,124.12 23.38,125.38 54.75,125.38 57.25,122.88 57.25,120.88 52.62,120.88 51.38,122.12 50.88,122.12 C.14
BUSB_REGOUT1  (via drill 0.35)
  Top 0.152: v23.12,124.25 17.38,118.5 17.38,113 14,109.62 IC11.14
  Bottom 0.152: v23.12,124.25 23.88,125 49.5,125 50.88,123.62 56,123.62 56.88,122.75 56.88,121.25 54.25,121.25 53.38,122.12 C.16
BUSB_REGOUT2  (via drill 0.35)
  Top 0.152: v24.12,124.38 17.75,118 17.75,110.75 14,107 IC11.13
  Bottom 0.152: v24.12,124.38 49.62,124.38 50.75,123.25 54.88,123.25 C.18
CLK  (via drill 0.35)
  Top 0.152: IC4.12 21.59,107.64 22.48,106.76 22.48,104.7 21.59,103.81 IC15.12 21.59,93.67 22.48,92.79 22.48,90.73 21.59,89.84 IC7.12 21.59,79.7 22.48,78.82 22.48,76.76 21.59,75.87 IC21.12 21.62,71.38 22.25,70.75 v22.25,68.88 | IC31.12 37.15,50.81 38.04,49.92 38.04,47.87 37.15,46.98 IC34.12 37.15,36.84 38.04,35.95 38.04,33.9 37.15,33.01 IC37.12 37.15,22.87 38.04,21.98 38.04,19.93 37.15,19.04 IC40.12 | 21.5,113 IC4.12 | v26.5,118.25 21.62,113.38 IC4.12 | v15.12,68.12 15.25,68 v15.25,60.62
  Bottom 0.152: v26.5,118.25 38.12,118.25 38.62,118.75 39.75,118.75 40.62,119.62 C.5 | v22.25,68.88 21.5,68.12 v15.12,68.12 | v15.25,60.62 15.62,60.25 31.75,60.25 33.88,58.12 35.62,58.12 37.12,56.62 IC31.12
GND  (via drill 0.35)
  Top 0.152: v43.18,115.89 39.37,115.89 39.3,115.82 | 39.3,115.82 IC4.18 | v56.52,109.54 IC5.10 | v56.52,95.57 IC16.10 | v56.52,81.6 IC9.10 | v56.52,67.63 IC22.10 56.5,62.5 56.5,61 v57,60.5 | v43.18,101.92 39.37,101.92 IC15.18 | v43.18,87.95 39.37,87.95 IC7.18 | v43.18,73.98 39.37,73.98 IC21.18 | IC21.10 IC21.11 IC7.10 IC7.11 IC15.10 IC15.11 IC4.10 IC4.11 19,113.5 | v58.74,59.05 54.93,59.05 IC31.18 | v72.07,52.7 IC32.10 v72.07,45.72 | v72.07,38.73 IC35.10 v72.07,31.75 | v72.07,24.77 IC38.10 v72.07,17.78 | v72.07,10.79 IC41.10 | v58.74,45.09 54.93,45.09 IC34.18 | v58.74,31.11 54.93,31.11 IC37.18 | v58.74,17.14 54.93,17.14 IC40.18 | IC40.10 34.5,7 34.5,14.5 IC40.11 34.5,15 34.5,20.5 IC37.10 | IC34.10 34.5,35 34.5,42.5 IC34.11 34.5,43 34.5,48.5 IC31.10 | IC1.5 20.38,19.75 20.38,22.12 IC1.4 | IC13.5 6.62,19.75 6.62,22.12 IC13.4 6.62,22.25 5,23.88 5,45 6.62,46.62 IC8.4 | IC8.9 14.25,36.62 14.25,39 IC8.10 | IC12.9 28,36.62 28,39 IC12.10 | C.4 38.12,122.12 38.12,119.75 C.3 38.12,119.62 39.25,118.5 39.25,115.88 39.3,115.82 | IC11.9 14,96.88 14,99.38 IC11.10 | IC10.9 6.38,74 6.38,76.5 IC10.10
  Bottom 0.152: IC4.18 35.24,111.76 20.64,111.76 IC4.11 | v43.18,115.89 44.02,115.89 44.32,116.19 54.94,116.19 55.72,115.41 | 55.8,115.33 55.72,115.41 | v56.52,109.54 IC6.10 56.52,114.62 55.72,115.41 | v56.52,95.57 IC17.10 55.8,101.01 55.8,101.36 54.94,102.22 44.32,102.22 44.02,101.92 v43.18,101.92 | IC15.18 35.24,97.79 20.64,97.79 IC15.11 | IC7.18 35.24,83.82 20.64,83.82 IC7.11 17.54,86.92 | v56.52,81.6 IC14.10 55.8,87.04 55.8,87.39 54.94,88.25 44.32,88.25 44.02,87.95 v43.18,87.95 | IC21.18 35.24,69.85 20.64,69.85 | 20.64,69.85 20.49,69.99 | 20.49,69.99 IC21.11 | v56.52,67.63 IC23.10 55.8,73.07 55.8,73.42 54.94,74.28 44.32,74.28 44.02,73.98 v43.18,73.98 | 17.46,87 17.48,86.98 | 17.48,86.98 17.54,86.92 | IC31.18 50.8,54.93 36.2,54.93 IC31.11 | 71.36,58.15 71.36,58.5 71.28,58.58 | 71.28,58.58 70.5,59.36 59.88,59.36 59.58,59.05 v58.74,59.05 58.5,59 v57,60.5 | v72.07,52.7 IC33.10 72.07,57.78 71.28,58.58 | IC36.10 v72.07,38.73 | IC36.10 71.36,44.18 71.36,44.53 70.5,45.39 59.88,45.39 59.58,45.09 v58.74,45.09 | IC34.18 50.8,40.96 36.2,40.96 IC34.11 | IC37.18 50.8,26.99 36.2,26.99 IC37.11 33.02,30.16 | IC39.10 v72.07,24.77 | IC39.10 71.36,30.21 71.36,30.56 70.5,31.42 59.88,31.42 59.58,31.11 v58.74,31.11 | IC40.18 50.8,13.02 36.2,13.02 IC40.11 33.5,13.5 | IC42.10 v72.07,10.79 | IC42.10 71.36,16.24 71.36,16.59 70.5,17.45 59.88,17.45 59.58,17.14 v58.74,17.14 | 33.5,13.5 33.02,13.02 33,13 27,13 20.38,19.62 IC1.5 | v72.07,45.72 IC36.10 | v72.07,31.75 IC39.10 | v72.07,17.78 IC42.10 | 33.5,13.5 | 17.5,87 17.48,86.98 | 19,106 IC4.10 19,105.75 7.5,105.75 6.38,106.88 IC11.4 | 19,99.5 IC15.11 | 20.5,70 20.49,69.99
  Bottom 0.152: IC1.4 20.25,22.12 19.38,21.25 7.62,21.25 6.75,22.12 IC13.4 | IC8.10 14.38,39 15.25,38.12 27,38.12 27.88,39 IC12.10 | IC10.4 14,84.25 16.62,86.88 17.5,86.88 17.54,86.92 | IC12.4 20.38,46.75 21.25,47.62 33.62,47.62 34.5,48.5 IC31.10 | IC10.9 6.38,73.88 10.38,69.88 20.62,69.88 20.64,69.85 | IC11.10 14,99.38 19,99.38 IC15.11 | IC12.9 28,36.5 29.5,35 34.5,35 IC34.10
N$1  (via drill 0.35)
  Top 0.152: IC5.19 45.64,114.98 45.64,115.33 44.48,116.48 | 44.48,116.48 44.48,116.49 | IC32.19 61.2,58.15 61.2,58.5 60.03,59.66 52.14,59.66 51.53,59.05 35.5,59.05 | 35.5,59.05 34.61,59.05 | v35.5,54.5 35.5,59.05 | 33,50 v33,50.38 v33,54.5 | v44.5,117.12 44.5,116.5 44.48,116.48 | v2,112.25 1.12,111.38 1.12,49.75 v2,48.88 | IC13.1 6.75,29.88 8.25,31.38 8.25,42.62 6.75,44.12 IC8.5 6.75,44.25 9.25,46.75 v9.25,50.12
  Bottom 0.152: v33,54.5 v35.5,54.5 | v44.5,117.12 44.25,116.88 6.62,116.88 v2,112.25 | v2,48.88 6.62,44.25 IC8.5 | v33,50.38 32.75,50.12 v9.25,50.12
N$5  (via drill 0.35)
  Top 0.152: v46.35,109.54 IC5.2
  Bottom 0.152: IC6.2 v46.35,109.54 30.48,109.54 IC4.7
N$6  (via drill 0.35)
  Top 0.152: IC5.3 v47.62,109.54 46.99,110.17 26.67,110.17 24.13,112.71 IC4.13
  Bottom 0.152: v47.62,109.54 IC6.3
N$7  (via drill 0.35)
  Top 0.152: v48.9,109.54 IC5.4
  Bottom 0.152: IC6.4 v48.9,109.54 48.26,108.9 32.38,108.9 IC4.6
N$8  (via drill 0.35)
  Top 0.152: IC5.5 v50.16,109.54 48.9,110.81 28.57,110.81 26.67,112.71 IC4.14
  Bottom 0.152: IC6.5 v50.16,109.54
N$9  (via drill 0.35)
  Top 0.152: v51.44,109.54 IC5.6
  Bottom 0.152: IC6.6 v51.44,109.54 50.83,108.93 48.92,108.93 48.26,108.27 34.29,108.27 IC4.5
N$10  (via drill 0.35)
  Top 0.152: IC5.7 v52.7,109.54 52.29,109.54 51.69,110.14 49.99,110.14 49.02,111.11 31.45,111.11 IC4.15
  Bottom 0.152: IC6.7 v52.7,109.54
N$11  (via drill 0.35)
  Top 0.152: v53.98,109.54 IC5.8
  Bottom 0.152: IC6.8 v53.98,109.54 53.34,108.9 51.23,108.9 50.95,108.63 49.25,108.63 48.26,107.63 36.2,107.63 IC4.4
N$15  (via drill 0.35)
  Top 0.152: IC5.9 v55.24,109.54
  Bottom 0.152: v55.24,109.54 IC6.9 55.24,114.62 53.97,115.89 46.36,115.89 45.8,115.33 45.8,113.36 44.24,111.8 41.54,111.8 41.02,112.32 41.02,113.61 39.74,114.9 33.92,114.9 32.37,113.35 IC4.16
N$22  (via drill 0.35)
  Top 0.152: v46.35,81.6 IC9.2
  Bottom 0.152: IC14.2 v46.35,81.6 30.48,81.6 IC7.7
N$23  (via drill 0.35)
  Top 0.152: IC9.3 v47.62,81.6 46.99,82.23 26.67,82.23 24.13,84.77 IC7.13
  Bottom 0.152: v47.62,81.6 IC14.3
N$24  (via drill 0.35)
  Top 0.152: v48.9,81.6 IC9.4
  Bottom 0.152: IC14.4 v48.9,81.6 48.26,80.96 32.38,80.96 IC7.6
N$25  (via drill 0.35)
  Top 0.152: IC9.5 v50.16,81.6 48.9,82.87 28.57,82.87 26.67,84.77 IC7.14
  Bottom 0.152: IC14.5 v50.16,81.6
N$28  (via drill 0.35)
  Top 0.152: v51.44,81.6 IC9.6
  Bottom 0.152: IC14.6 v51.44,81.6 50.83,80.99 48.92,80.99 48.26,80.33 34.29,80.33 IC7.5
N$34  (via drill 0.35)
  Top 0.152: IC5.1 44.41,104.14 23.18,104.14 v22.98,104.34 | v38.53,47.51 38.73,47.31 59.97,47.31 IC32.1 60.5,47.5 58,47.5 57.5,47 53.5,47 53.5,50 51.5,52 38,52 v38,53.5 | v15.62,103.5 15.62,88.88 15.38,88.62 15.38,88.12 15.62,87.88 15.62,83.25 14,81.62 IC10.5 | v16.25,42.88 16.25,34.5 16,34.25 16,29 14.38,27.38 IC13.15 | v30.12,43.12 31.75,44.75 v31.75,46.12 | v17.88,75.12 18.5,74.5 18.5,72.88 18,72.38 18,43.38 v18.25,43.12
  Bottom 0.152: v22.98,104.34 22.71,104.07 17.88,104.07 | 17.88,104.07 17.8,104.07 | v38.53,47.51 38.26,47.24 33.38,47.24 | 33.38,47.24 33.36,47.24 | v15.62,103.5 16.12,104 17.88,104 17.88,104.07 | v16.25,42.88 16.5,43.12 v18.25,43.12 v30.12,43.12 | v31.75,46.12 32.88,47.25 33.38,47.25 33.38,47.24 | v17.88,75.12 9.62,75.12 9.62,77.62 10,78 10.38,78 13.88,81.5 IC10.5
N$35  (via drill 0.35)
  Top 0.152: IC9.7 v52.7,81.6 52.29,81.6 51.69,82.2 49.99,82.2 49.02,83.17 31.45,83.17 IC7.15
  Bottom 0.152: IC14.7 v52.7,81.6
N$36  (via drill 0.35)
  Top 0.152: v53.98,81.6 IC9.8
  Bottom 0.152: IC14.8 v53.98,81.6 53.34,80.96 51.23,80.96 50.95,80.69 49.25,80.69 48.26,79.69 36.2,79.69 IC7.4
N$37  (via drill 0.35)
  Top 0.152: v55.24,81.6 IC9.9
  Bottom 0.152: v55.24,81.6 IC14.9 55.24,86.68 53.97,87.95 46.36,87.95 45.8,87.39 45.8,85.42 44.24,83.86 41.54,83.86 41.02,84.38 41.02,85.67 39.74,86.96 33.92,86.96 32.37,85.41 IC7.16
N$41  (via drill 0.35)
  Top 0.152: v46.35,95.57 IC16.2
  Bottom 0.152: IC17.2 v46.35,95.57 30.48,95.57 IC15.7
N$42  (via drill 0.35)
  Top 0.152: IC16.3 v47.62,95.57 46.99,96.2 26.67,96.2 24.13,98.74 IC15.13
  Bottom 0.152: v47.62,95.57 IC17.3
N$43  (via drill 0.35)
  Top 0.152: v48.9,95.57 IC16.4
  Bottom 0.152: IC17.4 v48.9,95.57 48.26,94.93 32.38,94.93 IC15.6
N$44  (via drill 0.35)
  Top 0.152: IC16.5 v50.16,95.57 48.9,96.84 28.57,96.84 26.67,98.74 IC15.14
  Bottom 0.152: IC17.5 v50.16,95.57
N$45  (via drill 0.35)
  Top 0.152: v51.44,95.57 IC16.6
  Bottom 0.152: IC17.6 v51.44,95.57 50.83,94.96 48.92,94.96 48.26,94.3 34.29,94.3 IC15.5
N$46  (via drill 0.35)
  Top 0.152: IC16.7 v52.7,95.57 52.29,95.57 51.69,96.17 49.99,96.17 49.02,97.14 31.45,97.14 IC15.15
  Bottom 0.152: IC17.7 v52.7,95.57
N$47  (via drill 0.35)
  Top 0.152: v53.98,95.57 IC16.8
  Bottom 0.152: IC17.8 v53.98,95.57 53.34,94.93 51.23,94.93 50.95,94.66 49.25,94.66 48.26,93.66 36.2,93.66 IC15.4
N$48  (via drill 0.35)
  Top 0.152: v55.24,95.57 IC16.9
  Bottom 0.152: v55.24,95.57 IC17.9 55.24,100.65 53.97,101.92 46.36,101.92 45.8,101.36 45.8,99.39 44.24,97.83 41.54,97.83 41.02,98.35 41.02,99.64 39.74,100.93 33.92,100.93 32.37,99.38 IC15.16
N$63  (via drill 0.35)
  Top 0.152: v46.35,67.63 IC22.2
  Bottom 0.152: IC23.2 v46.35,67.63 30.48,67.63 IC21.7
N$64  (via drill 0.35)
  Top 0.152: IC22.3 v47.62,67.63 46.99,68.26 26.67,68.26 24.13,70.8 IC21.13
  Bottom 0.152: v47.62,67.63 IC23.3
N$65  (via drill 0.35)
  Top 0.152: v48.9,67.63 IC22.4
  Bottom 0.152: IC23.4 v48.9,67.63 48.26,66.99 32.38,66.99 IC21.6
N$66  (via drill 0.35)
  Top 0.152: IC22.5 v50.16,67.63 48.9,68.9 28.57,68.9 26.67,70.8 IC21.14
  Bottom 0.152: IC23.5 v50.16,67.63
N$67  (via drill 0.35)
  Top 0.152: v51.44,67.63 IC22.6
  Bottom 0.152: IC23.6 v51.44,67.63 50.83,67.02 48.92,67.02 48.26,66.36 34.29,66.36 IC21.5
N$68  (via drill 0.35)
  Top 0.152: IC22.7 v52.7,67.63 52.29,67.63 51.69,68.23 49.99,68.23 49.02,69.2 31.45,69.2 IC21.15
  Bottom 0.152: IC23.7 v52.7,67.63
N$69  (via drill 0.35)
  Top 0.152: v53.98,67.63 IC22.8
  Bottom 0.152: IC23.8 v53.98,67.63 53.34,66.99 51.23,66.99 50.95,66.72 49.25,66.72 48.26,65.72 36.2,65.72 IC21.4
N$70  (via drill 0.35)
  Top 0.152: v55.24,67.63 IC22.9
  Bottom 0.152: v55.24,67.63 IC23.9 55.24,72.71 53.97,73.98 46.36,73.98 45.8,73.42 45.8,71.45 44.24,69.89 41.54,69.89 41.02,70.41 41.02,71.7 39.74,72.99 33.92,72.99 32.37,71.44 IC21.16
N$123  (via drill 0.35)  (1 unrouted)
  Top 0.152: v44,113.5 44.5,113 47,113 | v11.62,32 v11.62,25.62 | v13.25,32 15.88,34.62 15.88,42.38 15.62,42.62 15.62,43.5 16,43.88 16,50.38 16.5,50.88 16.5,61.12 v16.25,61.38 | v43.5,60 v42.5,61 | v2,104.38 1.5,103.88 1.5,61.88 v2,61.38 | IC31.3 50.8,50.48 38.34,50.48 v37.75,51.06 | IC4.3 35.24,107.31 22.78,107.31 v22.2,107.9 | 33,45.5 33,49.5 v34.5,51 | v4.38,27.12 4.62,27.38 4.62,47.62 v5.25,48.25 | v17.62,106.38 16.88,105.62 v16.88,93.38 | v4.12,92.88 3.88,92.62 3.88,88.88 3.12,88.12 3.12,62.62 4.25,61.5 v4.25,49.25
  Bottom 0.152: IC33.1 59.62,58.45 58.49,58.45 57.88,59.05 43.5,59.05 | 43.5,59.05 34.61,59.05 | v44,113.5 44.5,113.5 45,114 IC6.1 44.07,115.28 42.93,115.28 42.32,115.89 42.25,115.88 42.88,116.5 45.12,116.5 45.12,117.38 44.75,117.75 44.25,117.75 43.75,117.25 1.38,117.25 1.38,109.38 4.25,106.5 | v43.5,60 43.5,59.05 | 43.5,59 43.5,59.05 | 4.25,106.5 6.25,104.5 IC11.5 | v11.62,25.62 13.5,25.62 14.25,24.88 IC13.14 | v13.25,32 v11.62,32 | v42.5,61 16.62,61 v16.25,61.38 v2,61.38 | 4.25,106.5 2.12,104.38 v2,104.38 | IC31.2 IC31.3 | v37.75,51.06 35,51.06 | 35,51.06 34.65,51.06 | IC4.2 IC4.3 | 19.12,107.9 v22.2,107.9 22,108 | 19.12,107.9 19.09,107.9 | 35,51.06 35,51 v34.5,51 31.5,48 5.5,48 v5.25,48.25 v4.25,49.25 | v4.38,27.12 6.62,24.88 IC13.3 | v17.62,106.38 19.12,107.88 19.12,107.9 | v16.88,93.38 16.38,92.88 v4.12,92.88
N$124  (via drill 0.35)
  Top 0.152: v16.62,30.12 16.62,42.38 16.88,42.62 16.88,43.62 | v16.25,101.88 16.25,89 16.62,88.62 v16.62,84.88 | v18.38,83.12 18.5,83 18.5,79.25 17.88,78.62 v17.88,76.5 | v16.25,75.75 16,75.5 16,69.62 16.88,68.75 16.88,43.62 | 16.88,43.62 v16.62,43.88
  Bottom 0.152: IC33.19 61.2,48.7 61.2,49.05 61.06,49.18 60.22,49.18 58.35,47.31 40.96,47.31 | 33,45.06 33.91,45.06 34.21,44.76 38.41,44.76 40.96,47.31 | 33,45.06 32.99,45.06 | 34.77,51.75 38.89,51.75 40.96,49.69 40.96,47.31 | IC6.19 45.64,105.53 45.64,105.88 45.51,106.02 44.66,106.02 42.79,104.14 25.4,104.14 | 25.4,104.14 22.85,101.59 18.65,101.59 18.35,101.89 17.43,101.89 17.38,101.88 v16.25,101.88 | 19.21,108.58 23.34,108.58 25.4,106.52 25.4,104.14 | 33,45 33,45.06 | v16.62,30.12 14.62,30.12 14.38,29.88 IC13.16 | v16.62,43.88 16.88,44.12 20.25,44.12 IC12.5 20.38,44.25 21.25,45.12 33,45.12 33,45.06 | v18.38,83.12 v16.62,84.88 | v17.88,76.5 17.12,75.75 v16.25,75.75
N$128  (via drill 0.35)
  Top 0.152: v44.77,52.7 53.66,52.7 IC31.1 | v29.21,109.54 38.1,109.54 IC4.1 | v24.12,23.88 24.62,24.38 v24.62,51.38 | v4.25,110.88 3.5,110.12 v3.5,97.38 | v6.5,72.75 6.25,72.5 6.25,58.88 v7.62,57.5
  Bottom 0.152: IC31.19 54.3,56.52 52.12,54.33 46.39,54.33 v44.77,52.7 | v44.77,52.7 34,52.7 | 34,52.7 33.96,52.7 | IC4.19 38.75,113.35 36.56,111.16 30.84,111.16 v29.21,109.54 29,109.5 27.5,111 27.38,110.88 v4.25,110.88 | 44.5,52.5 v44.77,52.7 | v24.12,23.88 10.12,23.88 6.75,27.25 IC13.2 | 26,52.75 v24.62,51.38 | 26,52.75 34,52.75 34,52.7 | v3.5,97.38 2.62,96.5 2.12,96.5 1.88,96.25 1.88,72.75 v6.5,72.75 | v7.62,57.5 12.38,52.75 26,52.75
N$129  (via drill 0.35)
  Top 0.152: v61.91,52.7 IC32.2
  Bottom 0.152: IC33.2 v61.91,52.7 46.04,52.7 IC31.7
N$130  (via drill 0.35)
  Top 0.152: IC32.3 v63.18,52.7 62.55,53.34 42.23,53.34 39.69,55.88 IC31.13
  Bottom 0.152: v63.18,52.7 IC33.3
N$131  (via drill 0.35)
  Top 0.152: v64.45,52.7 IC32.4
  Bottom 0.152: IC33.4 v64.45,52.7 63.82,52.07 47.94,52.07 IC31.6
N$132  (via drill 0.35)
  Top 0.152: IC32.5 v65.72,52.7 64.45,53.98 44.13,53.98 42.23,55.88 IC31.14
  Bottom 0.152: IC33.5 v65.72,52.7
N$133  (via drill 0.35)
  Top 0.152: v66.99,52.7 IC32.6
  Bottom 0.152: IC33.6 v66.99,52.7 66.39,52.1 64.48,52.1 63.82,51.44 49.85,51.44 IC31.5
N$134  (via drill 0.35)
  Top 0.152: IC32.7 v68.26,52.7 67.85,52.7 67.24,53.31 65.55,53.31 64.58,54.28 47,54.28 IC31.15
  Bottom 0.152: IC33.7 v68.26,52.7
N$135  (via drill 0.35)
  Top 0.152: v69.53,52.7 IC32.8
  Bottom 0.152: IC33.8 v69.53,52.7 68.9,52.07 66.79,52.07 66.51,51.79 64.81,51.79 63.82,50.8 51.75,50.8 IC31.4
N$136  (via drill 0.35)
  Top 0.152: IC32.9 v70.8,52.7
  Bottom 0.152: v70.8,52.7 IC33.9 70.8,57.78 69.53,59.05 61.91,59.05 61.36,58.5 61.36,56.52 59.8,54.97 57.1,54.97 56.58,55.49 56.58,56.78 55.3,58.06 49.48,58.06 47.93,56.52 IC31.16
N$137  (via drill 0.35)
  Top 0.152: IC34.3 51.77,34.92 50.22,36.47 38.43,36.47 v37.75,37.15 | IC15.3 36.21,91.76 34.66,93.31 22.87,93.31 v22.2,93.98 | v18.75,37.38 18.75,32.25 18.38,31.88 18.38,11.12 5.62,11.12 5,11.75 5,12.88 6.62,14.5 IC13.7 6.62,14.62 3.38,17.88 3.38,61.88 2.62,62.62 2.62,88.12 3.5,89 3.5,93.25 v4.25,94
  Bottom 0.152: IC34.2 IC34.3 | IC15.2 IC15.3 | v22.2,93.98 18.5,93.98 18.5,94 v4.25,94 | 37,36.5 37.5,37 v37.75,37.15 33.67,37.15 33.62,37.12 33.25,37.5 18.88,37.5 v18.75,37.38
N$138  (via drill 0.35)
  Top 0.152: v44.77,38.73 53.66,38.73 IC34.1 | v29.21,95.57 38.1,95.57 IC15.1 | v30.5,20.88 30.75,21.12 v30.75,38.12 | v9.12,94.88 9,94.75 9,69.38 9.75,68.62 v9.75,59.12 | v22.25,55.25 25.25,52.25 v25.25,41.88
  Bottom 0.152: IC34.19 54.3,42.55 52.12,40.36 46.39,40.36 v44.77,38.73 44.75,38.62 31.25,38.62 30.88,38.25 | IC15.19 38.75,99.38 36.56,97.19 30.84,97.19 v29.21,95.57 29,95.5 28.5,95 17.5,95 17.38,94.88 v9.12,94.88 | v30.5,20.88 10.38,20.88 6.75,17.25 IC13.6 | v9.75,59.12 13.62,55.25 v22.25,55.25 | v25.25,41.88 27.12,40 29.12,40 30.88,38.25 | 30.88,38.25 v30.75,38.12
N$139  (via drill 0.35)
  Top 0.152: v61.91,38.73 IC35.2
  Bottom 0.152: IC36.2 v61.91,38.73 46.04,38.73 IC34.7
N$140  (via drill 0.35)
  Top 0.152: IC35.3 v63.18,38.73 62.55,39.37 42.23,39.37 39.69,41.91 IC34.13
  Bottom 0.152: v63.18,38.73 IC36.3
N$141  (via drill 0.35)
  Top 0.152: v64.45,38.73 IC35.4
  Bottom 0.152: IC36.4 v64.45,38.73 63.82,38.1 47.94,38.1 IC34.6
N$142  (via drill 0.35)
  Top 0.152: IC35.5 v65.72,38.73 64.45,40.01 44.13,40.01 42.23,41.91 IC34.14
  Bottom 0.152: IC36.5 v65.72,38.73
N$143  (via drill 0.35)
  Top 0.152: v66.99,38.73 IC35.6
  Bottom 0.152: IC36.6 v66.99,38.73 66.39,38.13 64.48,38.13 63.82,37.47 49.85,37.47 IC34.5
N$144  (via drill 0.35)
  Top 0.152: IC35.7 v68.26,38.73 67.85,38.73 67.24,39.34 65.55,39.34 64.58,40.31 47,40.31 IC34.15
  Bottom 0.152: IC36.7 v68.26,38.73
N$145  (via drill 0.35)
  Top 0.152: v69.53,38.73 IC35.8
  Bottom 0.152: IC36.8 v69.53,38.73 68.9,38.1 66.79,38.1 66.51,37.82 64.81,37.82 63.82,36.83 51.75,36.83 IC34.4
N$146  (via drill 0.35)
  Top 0.152: v70.8,38.73 IC35.9
  Bottom 0.152: v70.8,38.73 IC36.9 70.8,43.81 69.53,45.09 61.91,45.09 61.36,44.53 61.36,42.55 59.8,41 57.1,41 56.58,41.52 56.58,42.81 55.3,44.09 49.48,44.09 47.93,42.55 IC34.16
N$147  (via drill 0.35)
  Top 0.152: IC37.3 51.77,20.95 50.22,22.5 39.05,22.5 v39.05,26.35 | IC7.3 36.21,77.79 34.66,79.34 23.5,79.34 v23.5,80.75 | v23.5,80.75 v23.5,83.19 | v22.88,28.12 22.88,27.38 20.38,24.88 IC1.3 | v10.25,28.25 9.88,28.62 9.88,53.62 10.75,54.5 10.75,75.62 10.25,76.12 v10.25,77.38 | v23.5,80.75
  Bottom 0.152: IC37.2 IC37.3 | 38.73,26.67 v39.05,26.35 39,26.5 34.5,26.5 32.5,28.5 23.25,28.5 v22.88,28.12 | IC7.2 IC7.3 | 23.18,83.5 v23.5,83.19 23.5,83.5 21,83.5 | v10.25,28.25 12.5,26 19.12,26 20.25,24.88 IC1.3 | v10.25,77.38 13.12,80.25 21.5,80.25 22,80.75 v23.5,80.75
N$148  (via drill 0.35)
  Top 0.152: v44.77,24.77 53.66,24.77 IC37.1 | v29.21,81.6 38.1,81.6 IC7.1 | v34.5,25 33.5,24 33.5,20 34,19.5 34,16 33.5,15.5 33.5,9.5 33,9 | v13.5,28.62 12.62,29.5 12.62,71.38 v13.38,72.12
  Bottom 0.152: IC37.19 54.3,28.57 52.12,26.39 46.39,26.39 v44.77,24.77 44.5,25 v34.5,25 33.75,25.75 21.88,25.75 IC1.2 19,28.62 v13.5,28.62 | IC7.19 38.75,85.41 36.56,83.22 30.84,83.22 v29.21,81.6 | IC7.1 41.5,77.5 40,76 37.5,76 35,73.5 18.5,73.5 17,72 13.5,72 v13.38,72.12
N$149  (via drill 0.35)
  Top 0.152: v61.91,24.77 IC38.2
  Bottom 0.152: IC39.2 v61.91,24.77 46.04,24.77 IC37.7
N$150  (via drill 0.35)
  Top 0.152: IC38.3 v63.18,24.77 62.55,25.4 42.23,25.4 39.69,27.94 IC37.13
  Bottom 0.152: v63.18,24.77 IC39.3
N$151  (via drill 0.35)
  Top 0.152: v64.45,24.77 IC38.4
  Bottom 0.152: IC39.4 v64.45,24.77 63.82,24.13 47.94,24.13 IC37.6
N$152  (via drill 0.35)
  Top 0.152: IC38.5 v65.72,24.77 64.45,26.04 44.13,26.04 42.23,27.94 IC37.14
  Bottom 0.152: IC39.5 v65.72,24.77
N$153  (via drill 0.35)
  Top 0.152: v66.99,24.77 IC38.6
  Bottom 0.152: IC39.6 v66.99,24.77 66.39,24.16 64.48,24.16 63.82,23.5 49.85,23.5 IC37.5
N$154  (via drill 0.35)
  Top 0.152: IC38.7 v68.26,24.77 67.85,24.77 67.24,25.37 65.55,25.37 64.58,26.34 47,26.34 IC37.15
  Bottom 0.152: IC39.7 v68.26,24.77
N$155  (via drill 0.35)
  Top 0.152: v69.53,24.77 IC38.8
  Bottom 0.152: IC39.8 v69.53,24.77 68.9,24.13 66.79,24.13 66.51,23.85 64.81,23.85 63.82,22.86 51.75,22.86 IC37.4
N$156  (via drill 0.35)
  Top 0.152: v70.8,24.77 IC38.9
  Bottom 0.152: v70.8,24.77 IC39.9 70.8,29.84 69.53,31.11 61.91,31.11 61.36,30.56 61.36,28.58 59.8,27.03 57.1,27.03 56.58,27.55 56.58,28.84 55.3,30.12 49.48,30.12 47.93,28.57 IC37.16
N$157  (via drill 0.35)
  Top 0.152: IC40.3 50.48,8.89 v37.78,8.89 | v35.24,24.13 35.88,23.5 35.88,10.64 v36.51,10 | IC21.3 34.92,65.72 v22.23,65.72 | v19.68,80.96 20.32,80.33 20.32,67.47 v20.95,66.83 | v19,57.62 23.5,53.12 23.5,17.75 20.38,14.62 IC1.7 | v15.5,58 14,59.5 v14,62
  Bottom 0.152: IC40.2 IC40.3 | v37.78,8.89 37.62,8.89 v36.51,10 36.5,10.12 24.75,10.12 20.38,14.5 IC1.7 | IC21.2 IC21.3 | v22.23,65.72 22.07,65.72 v20.95,66.83 21,66.5 14,66.5 v14,62 | 35,24 v35.24,24.13 | v19,57.62 18.62,58 v15.5,58
N$158  (via drill 0.35)
  Top 0.152: v44.77,10.79 53.66,10.79 IC40.1 | v29.21,67.63 38.1,67.63 IC21.1 | v2.12,60.12 1.88,59.88 1.88,58.88 2.62,58.12 2.62,10.75 18.5,10.75 18.75,11 18.75,15.62 20.25,17.12 IC1.6
  Bottom 0.152: IC40.19 54.3,14.61 52.12,12.42 46.39,12.42 v44.77,10.79 | v44.77,10.79 33.88,10.79 | 33.88,10.79 33.81,10.79 | IC21.19 38.75,71.44 36.56,69.25 30.84,69.25 29.54,67.96 | 29.54,67.96 v29.21,67.63 29.12,67.75 27.38,69.5 1.38,69.5 1.38,60.88 v2.12,60.12 | 29.5,68 29.54,67.96 | 43,12.5 44.5,11 v44.77,10.79 | IC1.6 20.38,17.12 26.75,10.75 33.88,10.75 33.88,10.79
N$159  (via drill 0.35)
  Top 0.152: v61.91,10.79 IC41.2
  Bottom 0.152: IC42.2 v61.91,10.79 46.04,10.79 IC40.7
N$160  (via drill 0.35)
  Top 0.152: IC41.3 v63.18,10.79 62.55,11.43 42.23,11.43 39.69,13.97 IC40.13
  Bottom 0.152: v63.18,10.79 IC42.3
N$161  (via drill 0.35)
  Top 0.152: v64.45,10.79 IC41.4
  Bottom 0.152: IC42.4 v64.45,10.79 63.82,10.16 47.94,10.16 IC40.6
N$162  (via drill 0.35)
  Top 0.152: IC41.5 v65.72,10.79 64.45,12.06 44.13,12.06 42.23,13.97 IC40.14
  Bottom 0.152: IC42.5 v65.72,10.79
N$163  (via drill 0.35)
  Top 0.152: v66.99,10.79 IC41.6
  Bottom 0.152: IC42.6 v66.99,10.79 66.39,10.19 64.48,10.19 63.82,9.53 49.85,9.53 IC40.5
N$164  (via drill 0.35)
  Top 0.152: IC41.7 v68.26,10.79 67.85,10.79 67.24,11.4 65.55,11.4 64.58,12.37 47,12.37 IC40.15
  Bottom 0.152: IC42.7 v68.26,10.79
N$165  (via drill 0.35)
  Top 0.152: v69.53,10.79 IC41.8
  Bottom 0.152: IC42.8 v69.53,10.79 68.9,10.16 66.79,10.16 66.51,9.88 64.81,9.88 63.82,8.89 51.75,8.89 IC40.4
N$166  (via drill 0.35)
  Top 0.152: v70.8,10.79 IC41.9
  Bottom 0.152: v70.8,10.79 IC42.9 70.8,15.87 69.53,17.14 61.91,17.14 61.36,16.59 61.36,14.61 59.8,13.06 57.1,13.06 56.58,13.58 56.58,14.87 55.3,16.15 49.48,16.15 47.93,14.61 IC40.16
N$167  (via drill 0.35)
  Top 0.152: IC35.19 61.2,44.18 61.2,44.53 60.03,45.69 52.14,45.69 51.53,45.09 39.96,45.09 38.42,46.63 v37.78,46.63 | IC16.19 45.64,101.01 45.64,101.36 44.48,102.52 38.5,102.52 | 38.5,102.52 36.58,102.52 35.97,101.92 24.4,101.92 22.86,103.46 v22.23,103.46 | 38.5,102.52 38.5,102 37.5,101 22.5,101 v22.5,97 | v11.25,41.62 11.25,40.62 12.25,39.62 12.25,19.25 14.25,17.25 IC13.11 | v10.62,95.5 9.38,94.25 9.38,70.25 10.38,69.25 10.38,54.62 8.62,52.88 v8.62,47
  Bottom 0.152: 33.62,46.63 v37.78,46.63 37.5,46.5 | 33.62,46.63 33.61,46.63 | v22.23,103.46 18.05,103.46 | v22.5,97 21,95.5 v10.62,95.5 | 9.75,41.62 6.75,41.62 IC8.6 | 9.75,41.62 v11.25,41.62 | 9.75,41.62 11.88,43.75 | 11.88,43.75 13.62,45.5 32.5,45.5 33.62,46.62 33.62,46.63 | 11.88,43.75 v8.62,47
N$168  (via drill 0.35)
  Top 0.152: v18.12,40.75 18.12,40.25 17.38,39.5 17.38,17.62 14.38,14.62 IC13.10 | v11.75,87.62 10.88,86.75 10.88,76 11.12,75.75 11.12,42.88 10.25,42 10.25,33.88 v10.5,33.62
  Bottom 0.152: IC36.19 61.2,34.73 61.2,35.08 61.06,35.21 59.98,35.21 58.1,33.34 37.8,33.34 37.53,33.07 32.88,33.07 | 32.88,33.07 32.84,33.07 | IC17.19 45.64,91.56 45.64,91.91 45.51,92.05 44.42,92.05 42.55,90.17 22.24,90.17 22.03,89.97 | 22.03,89.97 21.97,89.9 | 22.03,89.97 22,90 17,90 16,89 15.75,89 14.38,87.62 v11.75,87.62 | 18.25,40.88 18.88,41.5 20.25,41.5 IC12.6 | 13,38.38 12.62,38.75 12.62,40.25 16.38,40.25 17,40.88 18.25,40.88 | 13,38.38 13.25,38.12 14.62,38.12 19.62,33.12 32.88,33.12 32.88,33.07 | 18.25,40.88 v18.12,40.75 | v10.5,33.62 10.5,38.38 13,38.38
N$169  (via drill 0.35)
  Top 0.152: IC35.1 59.97,33.34 39.92,33.34 v39.22,32.63 | 33.66,32.07 v33.97,32.38 34,32.5 33.5,33 33.5,34.5 | IC16.1 44.41,90.17 24.37,90.17 v23.66,89.46 | v16,88.38 16,81.12 14,79.12 IC10.6 13.88,79 11.5,79 11.5,42.75 10.62,41.88 10.62,34.38 11.62,33.38 v11.62,33 | v18,32.38 18,15.75 14.38,12.12 IC13.9
  Bottom 0.152: v39.22,32.63 34.14,32.63 33.89,32.38 v33.97,32.38 33.88,32.38 v18,32.38 17.75,32.62 12,32.62 v11.62,33 | v23.66,89.46 18.62,89.46 | 18.62,89.46 18.58,89.46 | v16,88.38 17.12,89.5 18.62,89.5 18.62,89.46
N$170  (via drill 0.35)
  Top 0.152: v53.02,45.09 52.72,44.78 39.67,44.78 38.73,45.72 v37.78,45.72 | v37.47,101.92 37.16,101.61 24.12,101.61 23.18,102.55 v22.23,102.55 | 33,45 33,38.5 32.62,38.12 32.62,32.38 v32,31.75 | 33,45 33.5,45.5 v33.66,45.72 | v10.88,31.38 10.88,16.25 6.75,12.12 IC13.8 | v5.62,95.62 8,93.25 8,88.88 7.25,88.12 4.12,88.12 v4.12,68.88 | v9.12,57.5 v9.12,63.88 | v30.12,53.38 32.38,51.12 32.38,45.62 33,45
  Bottom 0.152: v53.02,45.09 53.35,44.76 57.17,44.76 58.47,43.46 IC36.1 | v37.78,45.72 v33.66,45.72 | v37.47,101.92 37.8,101.59 41.62,101.59 42.91,100.29 IC17.1 | v22.23,102.55 18.12,102.55 | 18.12,102.55 18.1,102.55 | 18.12,102.55 18.12,102.62 17.88,102.88 7.25,102.88 6.38,102 IC11.6 6.25,101.88 4.38,100 2.25,100 1.88,99.62 1.88,98.25 3.5,98.25 4.75,97 4.75,95.62 v5.62,95.62 | v10.88,31.38 22,31.38 22.62,32 31.75,32 v32,31.75 | v9.12,63.88 v4.12,68.88 | v9.12,57.5 13.25,53.38 v30.12,53.38
N$171  (via drill 0.35)